# EAGLE design SheeldV3 (EAGLE 8.6.3)
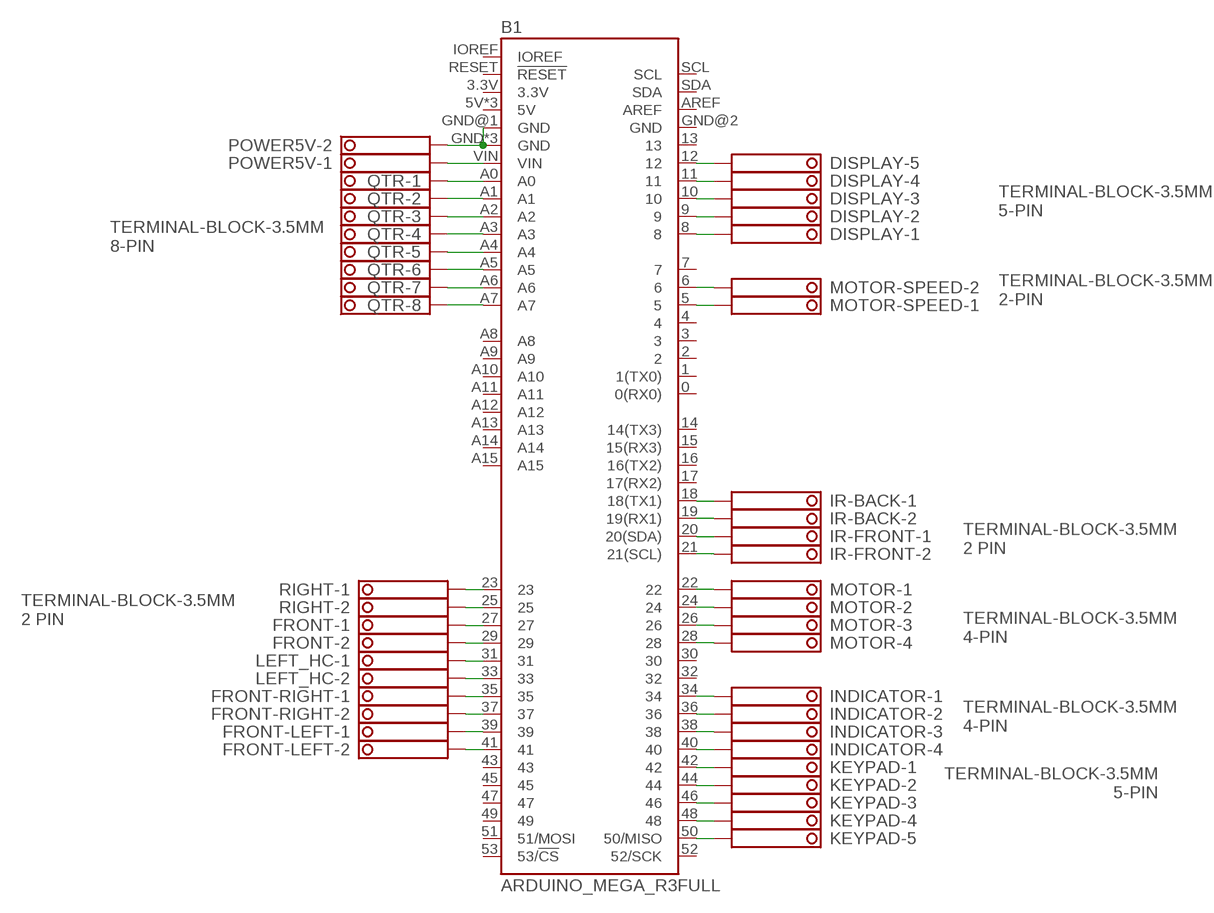
[diagram p0: schematic, sheet 1]

## Parts
B1  ARDUINO_MEGA_R3FULL  [ARDUINO_MEGA_NO_SILK]
DISPLAY  TERMINAL-BLOCK-3.5MM-5-PIN-LONG-PAD  [TERMINAL-BLOCK-5-PIN-3.5MM-LONG-PAD]
FRONT  TERMINAL-BLOCK-3.5MM-2-PIN-LONG-PAD  [TERMINAL-BLOCK-2-PIN-3.5MM-LONG-PAD]
FRONT-LEFT  TERMINAL-BLOCK-3.5MM-2-PIN-LONG-PAD  [TERMINAL-BLOCK-2-PIN-3.5MM-LONG-PAD]
FRONT-RIGHT  TERMINAL-BLOCK-3.5MM-2-PIN-LONG-PAD  [TERMINAL-BLOCK-2-PIN-3.5MM-LONG-PAD]
INDICATOR  TERMINAL-BLOCK-3.5MM-4-PIN-LONG-PAD  [TERMINAL-BLOCK-4-PIN-3.5MM-LONG-PAD]
IR-BACK  TERMINAL-BLOCK-3.5MM-2-PIN-LONG-PAD  [TERMINAL-BLOCK-2-PIN-3.5MM-LONG-PAD]
IR-FRONT  TERMINAL-BLOCK-3.5MM-2-PIN-LONG-PAD  [TERMINAL-BLOCK-2-PIN-3.5MM-LONG-PAD]
KEYPAD  TERMINAL-BLOCK-3.5MM-5-PIN-LONG-PAD  [TERMINAL-BLOCK-5-PIN-3.5MM-LONG-PAD]
LEFT_HC  TERMINAL-BLOCK-3.5MM-2-PIN-LONG-PAD  [TERMINAL-BLOCK-2-PIN-3.5MM-LONG-PAD]
MOTOR  TERMINAL-BLOCK-3.5MM-4-PIN-LONG-PAD  [TERMINAL-BLOCK-4-PIN-3.5MM-LONG-PAD]
MOTOR-SPEED  TERMINAL-BLOCK-3.5MM-2-PIN-LONG-PAD  [TERMINAL-BLOCK-2-PIN-3.5MM-LONG-PAD]
POWER5V  TERMINAL-BLOCK-3.5MM-2-PIN-LONG-PAD  [TERMINAL-BLOCK-2-PIN-3.5MM-LONG-PAD]
QTR  TERMINAL-BLOCK-3.5MM-8-PIN-LONG-PAD  [TERMINAL-BLOCK-8-PIN-3.5MM-LONG-PAD]
RIGHT  TERMINAL-BLOCK-3.5MM-2-PIN-LONG-PAD  [TERMINAL-BLOCK-2-PIN-3.5MM-LONG-PAD]

## Nets
N$1: B1.12 DISPLAY.5
N$2: B1.11 DISPLAY.4
N$3: B1.10 DISPLAY.3
N$4: B1.9 DISPLAY.2
N$5: B1.8 DISPLAY.1
N$6: B1.VIN POWER5V.1
N$7: B1.23 RIGHT.1
N$8: B1.25 RIGHT.2
N$9: B1.27 FRONT.1
N$10: B1.29 FRONT.2
N$11: B1.31 LEFT_HC.1
N$12: B1.33 LEFT_HC.2
N$13: B1.35 FRONT-RIGHT.1
N$14: B1.37 FRONT-RIGHT.2
N$15: B1.39 FRONT-LEFT.1
N$16: B1.41 FRONT-LEFT.2
N$17: B1.42 KEYPAD.1
N$18: B1.44 KEYPAD.2
N$19: B1.46 KEYPAD.3
N$20: B1.48 KEYPAD.4
N$21: B1.50(50/MISO) KEYPAD.5
N$22: B1.22 MOTOR.1
N$23: B1.24 MOTOR.2
N$24: B1.26 MOTOR.3
N$25: B1.28 MOTOR.4
N$26: B1.34 INDICATOR.1
N$27: B1.36 INDICATOR.2
N$28: B1.38 INDICATOR.3
N$29: B1.40 INDICATOR.4
N$30: B1.6 MOTOR-SPEED.2
N$31: B1.5 MOTOR-SPEED.1
N$32: B1.21(21(SCL)) IR-FRONT.2
N$33: B1.20(20(SDA)) IR-FRONT.1
N$34: B1.19(19(RX1)) IR-BACK.2
N$35: B1.18(18(TX1)) IR-BACK.1
N$36: B1.GND B1.GND@1(GND) B1.GND@3(GND) B1.GND@4(GND) POWER5V.2
N$37: B1.A0 QTR.1
N$38: B1.A1 QTR.2
N$39: B1.A2 QTR.3
N$40: B1.A3 QTR.4
N$41: B1.A4 QTR.5
N$42: B1.A5 QTR.6
N$43: B1.A6 QTR.7
N$44: B1.A7 QTR.8
Unconnected: B1.0(0(RX0)) B1.1(1(TX0)) B1.2 B1.3 B1.3.3V B1.4 B1.5V B1.5V@1(5V) B1.5V@2(5V) B1.7 B1.13 B1.14(14(TX3)) B1.15(15(RX3)) B1.16(16(TX2)) B1.17(17(RX2)) B1.30 B1.32 B1.43 B1.45 B1.47 B1.49 B1.51(51/MOSI) B1.52(52/SCK) B1.53(53/!CS) B1.A8 B1.A9 B1.A10 B1.A11 B1.A12 B1.A13 B1.A14 B1.A15 B1.AREF B1.GND@2(GND) B1.IOREF B1.RESET(!RESET) B1.SCL B1.SDA

## Notes on the sheet
- TERMINAL-BLOCK-3.5MM
  5-PIN
- TERMINAL-BLOCK-3.5MM
  8-PIN
- TERMINAL-BLOCK-3.5MM
  2-PIN
- TERMINAL-BLOCK-3.5MM
  2 PIN
- TERMINAL-BLOCK-3.5MM
  2 PIN
- TERMINAL-BLOCK-3.5MM
  4-PIN
- TERMINAL-BLOCK-3.5MM
  4-PIN
- TERMINAL-BLOCK-3.5MM
  5-PIN

## Library data of the parts
B1 = SparkFun-Boards:ARDUINO_MEGA_R3: Arduino Mega R3 ATmega2560 R3 compatible footprint. SparkFun Products: Arduino Mega 2560 R3 <https://www.sparkfun.com/products/11061>
DISPLAY KEYPAD = Rembrandt Electronics - Terminal Block 3-5mm v1-0:TERMINAL-BLOCK-3.5MM-5-PIN: Terminal Block 3.5mm Pitch: 3,5 mm Number of pins: 5 Created by Rembrandt Electronics www.rembrandtelectronics.com
FRONT FRONT-LEFT FRONT-RIGHT IR-BACK IR-FRONT LEFT_HC MOTOR-SPEED POWER5V RIGHT = Rembrandt Electronics - Terminal Block 3-5mm v1-0:TERMINAL-BLOCK-3.5MM-2-PIN: Terminal Block 3.5mm Pitch: 3,5 mm Number of pins: 2 Created by Rembrandt Electronics www.rembrandtelectronics.com
INDICATOR MOTOR = Rembrandt Electronics - Terminal Block 3-5mm v1-0:TERMINAL-BLOCK-3.5MM-4-PIN: Terminal Block 3.5mm Pitch: 3,5 mm Number of pins: 4 Created by Rembrandt Electronics www.rembrandtelectronics.com
QTR = Rembrandt Electronics - Terminal Block 3-5mm v1-0:TERMINAL-BLOCK-3.5MM-8-PIN: Terminal Block 3.5mm Pitch: 3,5 mm Number of pins: 8 Created by Rembrandt Electronics www.rembrandtelectronics.com

## Board
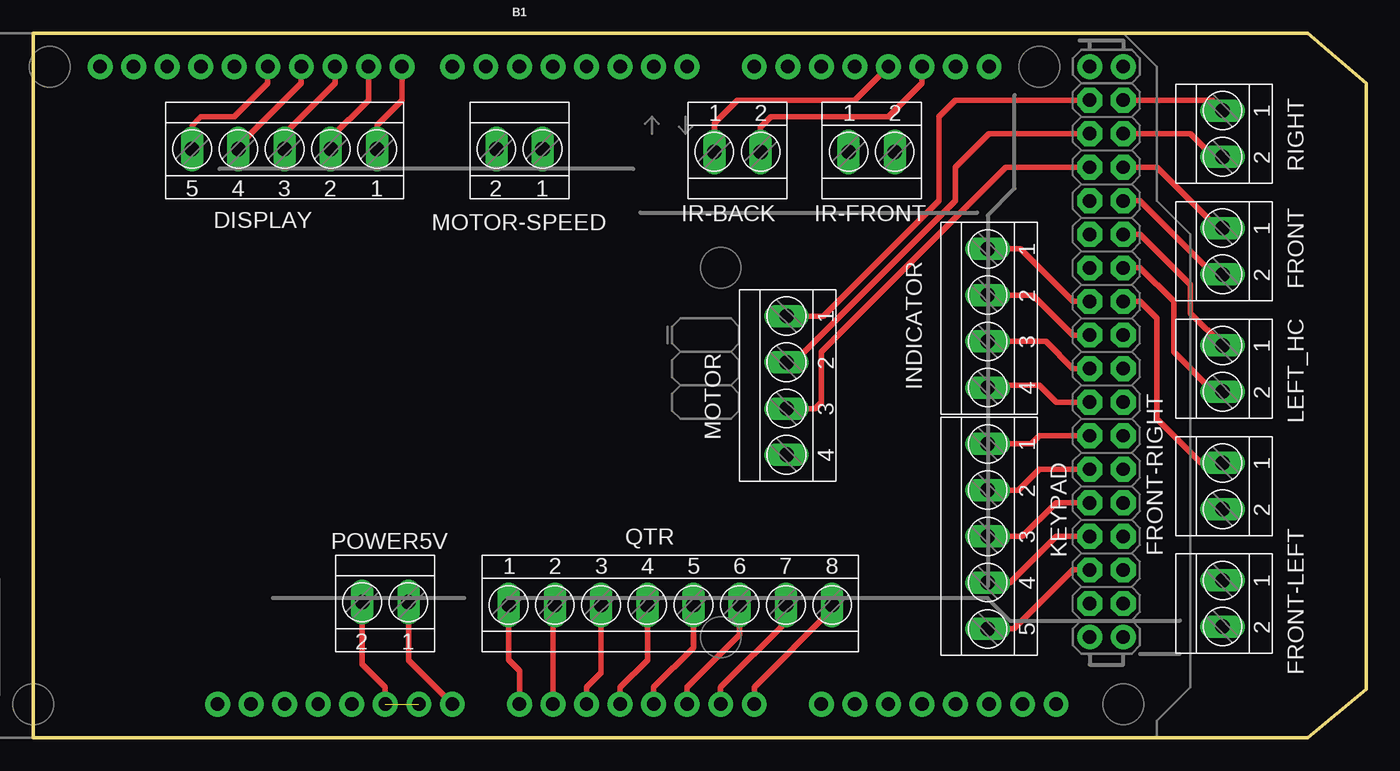
[diagram p1: board, top side]
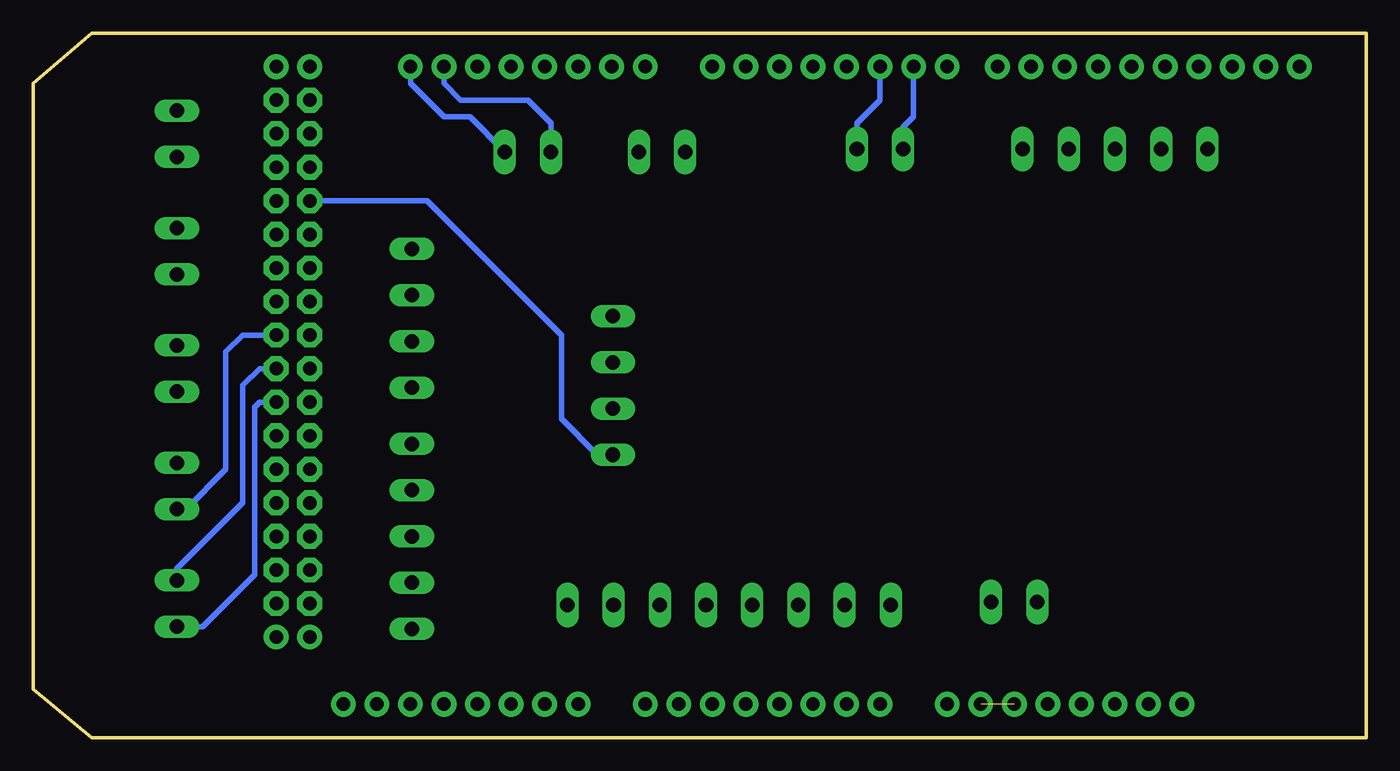
[diagram p2: board, bottom side, seen from below]

Size 100.96 x 53.34 mm. Coordinates in mm from the lower left corner, seen from the top.
Outline: 0,53.34 96.52,53.34 100.96,49.53 100.96,3.68 96.52,0 0,0 0,53.34
Copper layers (1*16): Top 0.035mm / dielectric 1.5mm / Bottom 0.035mm
Design rules "default": minimum track width 6mil, minimum drill 0.35mm, track to track 6mil, track to pad 6mil, pad to pad 6mil, via to via 6mil, smd to smd 6mil, copper to edge 40mil, drill to drill 6mil, minimum pad ring 10mil, minimum via ring 8mil, stop-mask expansion 4mil, vias tented up to drill 0mil, thermal gap 10mil

### Footprints (pad centres in the part's own frame; a part is rotated, then mirrored left to right if it is on the bottom)
ARDUINO_MEGA_NO_SILK = drill 1.016 pad 1.88: 0 13.97,24.13; 1 11.43,24.13; 2 8.89,24.13; 3 6.35,24.13; 3.3V -13.97,-24.13; 4 3.81,24.13; 5 1.27,24.13; 5V -11.43,-24.13; 5V@1 44.45,24.13; 5V@2 46.99,24.13; 6 -1.27,24.13; 7 -3.81,24.13; 8 -7.62,24.13; 9 -10.16,24.13; 10 -12.7,24.13; 11 -15.24,24.13; 12 -17.78,24.13; 13 -20.32,24.13; 14 19.05,24.13; 15 21.59,24.13; 16 24.13,24.13; 17 26.67,24.13; 18 29.21,24.13; 19 31.75,24.13; 20 34.29,24.13; 21 36.83,24.13; A0 1.27,-24.13; A1 3.81,-24.13; A2 6.35,-24.13; A3 8.89,-24.13; A4 11.43,-24.13; A5 13.97,-24.13; A6 16.51,-24.13; A7 19.05,-24.13; A8 24.13,-24.13; A9 26.67,-24.13; A10 29.21,-24.13; A11 31.75,-24.13; A12 34.29,-24.13; A13 36.83,-24.13; A14 39.37,-24.13; A15 41.91,-24.13; AREF -25.4,24.13; GND -8.89,-24.13; GND@1 -6.35,-24.13; GND@2 44.45,-19.05; GND@3 46.99,-19.05; GND@4 -22.86,24.13; IOREF -19.05,-24.13; NC -21.59,-24.13; RESET -16.51,-24.13; SCL -30.48,24.13; SDA -27.94,24.13; VIN -3.81,-24.13 | drill 1.016 pad 1.88 octagon: 22 44.45,21.59; 23 46.99,21.59; 24 44.45,19.05; 25 46.99,19.05; 26 44.45,16.51; 27 46.99,16.51; 28 44.45,13.97; 29 46.99,13.97; 30 44.45,11.43; 31 46.99,11.43; 32 44.45,8.89; 33 46.99,8.89; 34 44.45,6.35; 35 46.99,6.35; 36 44.45,3.81; 37 46.99,3.81; 38 44.45,1.27; 39 46.99,1.27; 40 44.45,-1.27; 41 46.99,-1.27; 42 44.45,-3.81; 43 46.99,-3.81; 44 44.45,-6.35; 45 46.99,-6.35; 46 44.45,-8.89; 47 46.99,-8.89; 48 44.45,-11.43; 49 46.99,-11.43; 50 44.45,-13.97; 51 46.99,-13.97; 52 44.45,-16.51; 53 46.99,-16.51
TERMINAL-BLOCK-5-PIN-3.5MM-LONG-PAD = drill 1.1 pad 1.7 long: 1 -7,-0.1; 2 -3.5,-0.1; 3 0,-0.1; 4 3.5,-0.1; 5 7,-0.1
TERMINAL-BLOCK-2-PIN-3.5MM-LONG-PAD = drill 1.1 pad 1.7 long: 1 -1.75,-0.1; 2 1.75,-0.1
TERMINAL-BLOCK-4-PIN-3.5MM-LONG-PAD = drill 1.1 pad 1.7 long: 1 -5.25,-0.1; 2 -1.75,-0.1; 3 1.75,-0.1; 4 5.25,-0.1
TERMINAL-BLOCK-8-PIN-3.5MM-LONG-PAD = drill 1.1 pad 1.7 long: 1 -12.25,-0.1; 2 -8.75,-0.1; 3 -5.25,-0.1; 4 -1.75,-0.1; 5 1.75,-0.1; 6 5.25,-0.1; 7 8.75,-0.1; 8 12.25,-0.1

### Placement (x,y rotation side)
B1  35.56,26.67 0 top
DISPLAY  19.05,44.45 180 top
FRONT  90.17,36.83 270 top
FRONT-LEFT  90.17,10.16 270 top
FRONT-RIGHT  90.17,19.05 270 top
INDICATOR  72.39,31.75 270 top
IR-BACK  53.34,44.45 0 top
IR-FRONT  63.5,44.45 0 top
KEYPAD  72.39,15.24 270 top
LEFT_HC  90.17,27.94 270 top
MOTOR  57.15,26.67 270 top
MOTOR-SPEED  36.83,44.45 180 top
POWER5V  26.67,10.16 180 top
QTR  48.26,10.16 0 top
RIGHT  90.17,45.72 270 top

### Tracks (layer width: path | path; a pad name or v marks a point on that pad's centre or on a via)
N$1
  Top 0.406: B1.12 17.78,49.53 15.24,46.99 12.7,46.99 12.05,46.34 DISPLAY.5
N$2
  Top 0.406: B1.11 20.32,49.53 15.55,44.76 DISPLAY.4
N$3
  Top 0.406: DISPLAY.3 19.05,45.72 22.86,49.53 B1.10
N$4
  Top 0.406: DISPLAY.2 22.55,45.41 25.4,48.26 B1.9
N$5
  Top 0.406: DISPLAY.1 26.05,46.37 27.94,48.26 B1.8
N$6
  Top 0.406: POWER5V.1 28.42,5.87 B1.VIN
N$7
  Top 0.406: RIGHT.1 89.28,48.26 B1.23
N$8
  Top 0.406: B1.25 87.63,45.72 89.38,43.97 RIGHT.2
N$9
  Top 0.406: B1.27 85.09,43.18 89.69,38.58 FRONT.1
N$10
  Top 0.406: B1.29 83.82,40.64 89.38,35.08 FRONT.2
N$11
  Top 0.406: B1.31 83.82,38.1 87.63,34.29 87.63,32.13 LEFT_HC.1
N$12
  Top 0.406: B1.33 83.82,35.56 86.36,33.02 86.36,29.21 89.38,26.19 LEFT_HC.2
N$13
  Top 0.406: B1.35 83.82,33.02 85.09,31.75 85.09,24.13 88.42,20.8 FRONT-RIGHT.1
N$14
  Bottom 0.406: B1.37 85.09,30.48 86.36,29.21 86.36,20.32 89.38,17.3 FRONT-RIGHT.2
N$15
  Bottom 0.406: B1.39 83.82,27.94 85.09,26.67 85.09,17.78 90.07,12.8 FRONT-LEFT.1
N$16
  Bottom 0.406: FRONT-LEFT.2 88.11,8.41 84.2,12.32 84.2,25.02 83.82,25.4 B1.41
N$17
  Top 0.406: B1.42 76.2,22.86 75.58,22.24 KEYPAD.1
N$18
  Top 0.406: KEYPAD.2 74.62,18.74 76.2,20.32 B1.44
N$19
  Top 0.406: KEYPAD.3 74.93,15.24 77.47,17.78 B1.46
N$20
  Top 0.406: KEYPAD.4 73.97,11.74 77.47,15.24 B1.48
N$21
  Top 0.406: KEYPAD.5 74.28,8.24 78.74,12.7 B1.50
N$22
  Top 0.406: B1.22 69.85,48.26 68.58,46.99 68.58,40.64 59.86,31.92 MOTOR.1
N$23
  Top 0.406: MOTOR.2 57.63,28.42 69.85,40.64 69.85,43.18 72.39,45.72 B1.24
N$24
  Top 0.406: B1.26 73.66,43.18 59.69,29.21 59.69,25.4 59.21,24.92 MOTOR.3
N$25
  Bottom 0.406: B1.28 71.12,40.64 60.96,30.48 60.96,24.13 58.25,21.42 MOTOR.4
N$26
  Top 0.406: B1.34 78.74,33.02 74.76,37 INDICATOR.1
N$27
  Top 0.406: B1.36 78.74,30.48 75.72,33.5 INDICATOR.2
N$28
  Top 0.406: B1.38 78.74,27.94 76.68,30 INDICATOR.3
N$29
  Top 0.406: INDICATOR.4 72.46,26.67 76.2,26.67 77.47,25.4 B1.40
N$30
  Bottom 0.406: B1.6 34.29,46.99 35.08,46.2 MOTOR-SPEED.2
N$31
  Bottom 0.406: MOTOR-SPEED.1 38.58,46.51 36.83,48.26 B1.5
N$32
  Bottom 0.406: B1.21 72.39,49.53 69.85,46.99 67.89,46.99 IR-FRONT.2
N$33
  Bottom 0.406: B1.20 69.85,49.53 68.58,48.26 63.5,48.26 61.75,46.51 IR-FRONT.1
N$34
  Top 0.406: IR-BACK.2 55.09,46.2 55.88,46.99 64.77,46.99 67.31,49.53 B1.19
N$35
  Top 0.406: IR-BACK.1 51.59,46.51 53.34,48.26 62.23,48.26 B1.18
N$36  (1 unrouted)
  Top 0.406: POWER5V.2 24.92,5.56 26.67,3.81 B1.GND
N$37
  Top 0.406: QTR.1 36.01,5.9 36.83,5.08 B1.A0
N$38
  Top 0.406: QTR.2 39.37,9.92 B1.A1
N$39
  Top 0.406: QTR.3 43.01,4.91 41.91,3.81 B1.A2
N$40
  Top 0.406: QTR.4 46.51,5.87 44.45,3.81 B1.A3
N$41
  Top 0.406: QTR.5 50.01,6.83 46.99,3.81 B1.A4
N$42
  Top 0.406: QTR.6 53.51,7.79 49.53,3.81 B1.A5
N$43
  Top 0.406: B1.A6 52.07,3.81 57.01,8.75 QTR.7
N$44
  Top 0.406: B1.A7 54.61,3.81 60.51,9.71 QTR.8